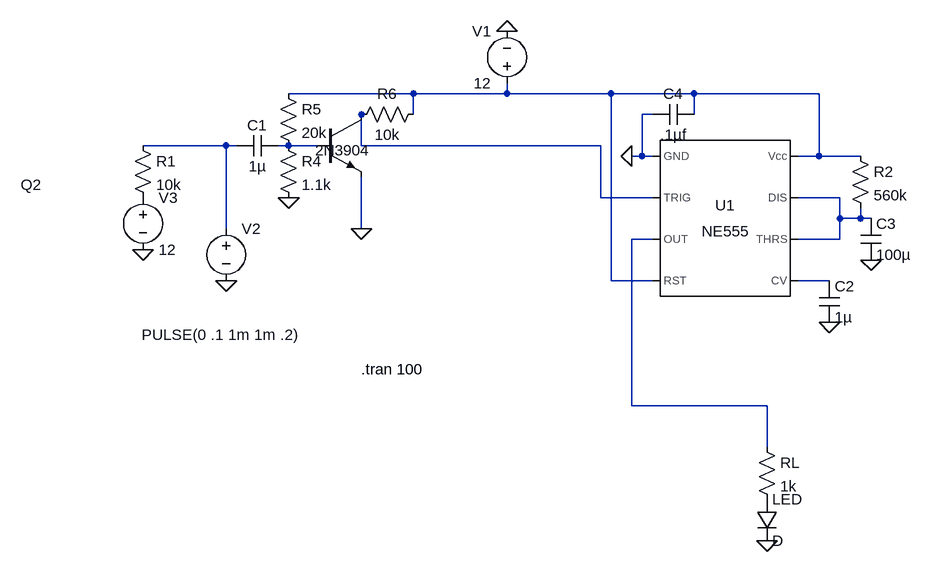
[diagram p0: schematic First-draft.asc]
First-draft.asc, the LTspice schematic file:
Version 4.1
SHEET 1 1860 772
WIRE 16 64 -176 64
WIRE 160 64 160 48
WIRE 160 64 16 64
WIRE 320 64 160 64
WIRE 448 64 320 64
WIRE 640 64 448 64
WIRE 16 96 16 64
WIRE 384 96 368 96
WIRE 448 96 448 64
WIRE -272 144 -400 144
WIRE -256 144 -272 144
WIRE -176 144 -192 144
WIRE -128 144 -176 144
WIRE -64 144 -64 96
WIRE 304 144 -64 144
WIRE 368 160 368 96
WIRE 368 160 352 160
WIRE 384 160 368 160
WIRE 640 160 640 64
WIRE 640 160 608 160
WIRE 704 160 640 160
WIRE 304 224 304 144
WIRE 384 224 304 224
WIRE 672 224 608 224
WIRE 672 256 672 224
WIRE 704 256 704 240
WIRE 704 256 672 256
WIRE 720 256 704 256
WIRE -272 272 -272 144
WIRE -64 272 -64 192
WIRE 384 288 352 288
WIRE 672 288 672 256
WIRE 672 288 608 288
WIRE 320 352 320 64
WIRE 384 352 320 352
WIRE 656 352 608 352
WIRE 352 544 352 288
WIRE 560 544 352 544
WIRE 560 608 560 544
FLAG 160 -32 0
FLAG -272 352 0
FLAG 352 160 0
FLAG 656 416 0
FLAG 720 320 0
FLAG -400 304 0
FLAG 560 752 0
FLAG -176 224 0
FLAG -64 272 0
SYMBOL voltage 160 64 R180
WINDOW 0 24 96 Left 2
WINDOW 3 24 16 Left 2
WINDOW 123 0 0 Left 0
WINDOW 39 0 0 Left 0
SYMATTR InstName V1
SYMATTR Value 12
SYMBOL voltage -272 256 R0
WINDOW 3 -130 179 Left 2
WINDOW 123 0 0 Left 0
WINDOW 39 0 0 Left 0
SYMATTR InstName V2
SYMATTR Value PULSE(0 .1 1m 1m .2)
SYMBOL Misc\\NE555 496 256 R0
SYMATTR InstName U1
SYMBOL cap 640 352 R0
SYMATTR InstName C2
SYMATTR Value 1µ
SYMBOL res 688 144 R0
SYMATTR InstName R2
SYMATTR Value 560k
SYMBOL cap 704 256 R0
SYMATTR InstName C3
SYMATTR Value 100µ
SYMBOL res 544 592 R0
SYMATTR InstName RL
SYMATTR Value 1k
SYMBOL voltage -400 208 R0
SYMATTR InstName V3
SYMATTR Value 12
SYMBOL res -416 128 R0
SYMATTR InstName R1
SYMATTR Value 10k
SYMBOL cap -192 128 R90
WINDOW 0 0 32 VBottom 2
WINDOW 3 32 32 VTop 2
SYMATTR InstName C1
SYMATTR Value 1µ
SYMBOL cap 448 80 R90
WINDOW 0 0 32 VBottom 2
WINDOW 3 32 32 VTop 2
SYMATTR InstName C4
SYMATTR Value .1µf
SYMBOL diode 544 688 R0
SYMATTR InstName LED
SYMBOL npn -128 96 R0
WINDOW 0 -460 108 Left 2
WINDOW 3 -7 55 Left 2
SYMATTR InstName Q2
SYMATTR Value 2N3904
SYMBOL res -192 128 R0
SYMATTR InstName R4
SYMATTR Value 1.1k
SYMBOL res -192 48 R0
SYMATTR InstName R5
SYMATTR Value 20k
SYMBOL res 32 80 R90
WINDOW 0 0 56 VBottom 2
WINDOW 3 32 56 VTop 2
SYMATTR InstName R6
SYMATTR Value 10k
TEXT -64 488 Left 2 !.tran 100

The netlist it stands for:
* First-draft.asc
V1 N001 0 12
V2 N002 0 PULSE(0 .1 1m 1m .2)
X§U1 0 N004 N006 N001 N007 N005 N005 N001 NE555  ; pins GND TRIG OUT RST CV THRS DIS Vcc
C2 N007 0 1µ
R2 N001 N005 560k
C3 N005 0 100µ
RL N006 P001 1k
V3 P002 0 12
R1 N002 P002 10k
C1 N003 N002 1µ
C4 N001 0 .1µf
D§LED P001 0 D
Q2 N004 N003 0 0 2N3904
R4 N003 0 1.1k
R5 N001 N003 20k
R6 N001 N004 10k
.model D D
.lib standard.dio
.model NPN NPN
.model PNP PNP
.lib standard.bjt
.tran 100
.lib NE555.sub
.backanno
.end